# Altium schematic sheet IOpins.SchDoc
size A
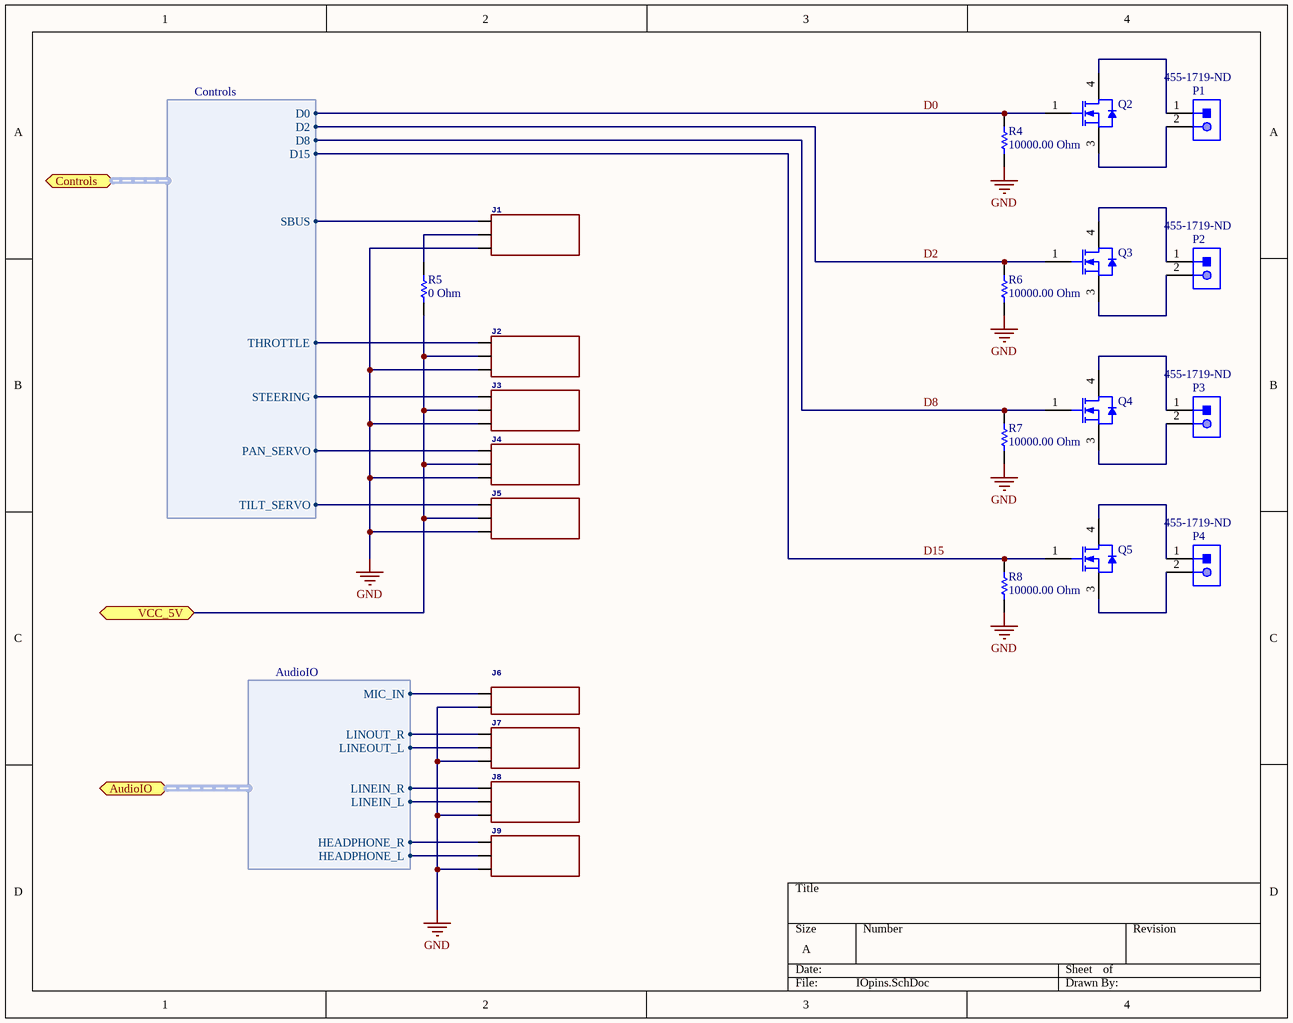
[diagram p0: IOpins.SchDoc]

## Parts
J1  Library:  MF_Connectors Description: Header Connector with 03 Positions and 01 Rows. Use the LABEL Attribute to label the pin on the schematic and PCB. You can remove the attributes on the PCB by using the SMASH function on the part and then deleting the text.  [PTH_2.54MM_01X03]  (value not drawn)
J2  Library:  MF_Connectors Description: Header Connector with 03 Positions and 01 Rows. Use the LABEL Attribute to label the pin on the schematic and PCB. You can remove the attributes on the PCB by using the SMASH function on the part and then deleting the text.  [PTH_2.54MM_01X03]  (value not drawn)
J3  Library:  MF_Connectors Description: Header Connector with 03 Positions and 01 Rows. Use the LABEL Attribute to label the pin on the schematic and PCB. You can remove the attributes on the PCB by using the SMASH function on the part and then deleting the text.  [PTH_2.54MM_01X03]  (value not drawn)
J4  Library:  MF_Connectors Description: Header Connector with 03 Positions and 01 Rows. Use the LABEL Attribute to label the pin on the schematic and PCB. You can remove the attributes on the PCB by using the SMASH function on the part and then deleting the text.  [PTH_2.54MM_01X03]  (value not drawn)
J5  Library:  MF_Connectors Description: Header Connector with 03 Positions and 01 Rows. Use the LABEL Attribute to label the pin on the schematic and PCB. You can remove the attributes on the PCB by using the SMASH function on the part and then deleting the text.  [PTH_2.54MM_01X03]  (value not drawn)
J6  Library:  MF_Connectors Description: Header Connector with 02 Positions and 01 Rows. Use the LABEL Attribute to label the pin on the schematic and PCB. You can remove the attributes on the PCB by using the SMASH function on the part and then deleting the text.  [PTH_2.54MM_01X02]  (value not drawn)
J7  Library:  MF_Connectors Description: Header Connector with 03 Positions and 01 Rows. Use the LABEL Attribute to label the pin on the schematic and PCB. You can remove the attributes on the PCB by using the SMASH function on the part and then deleting the text.  [PTH_2.54MM_01X03]  (value not drawn)
J8  Library:  MF_Connectors Description: Header Connector with 03 Positions and 01 Rows. Use the LABEL Attribute to label the pin on the schematic and PCB. You can remove the attributes on the PCB by using the SMASH function on the part and then deleting the text.  [PTH_2.54MM_01X03]  (value not drawn)
J9  Library:  MF_Connectors Description: Header Connector with 03 Positions and 01 Rows. Use the LABEL Attribute to label the pin on the schematic and PCB. You can remove the attributes on the PCB by using the SMASH function on the part and then deleting the text.  [PTH_2.54MM_01X03]  (value not drawn)
P1  Supplier Part Number 1: 455-1719-ND  [JST-S2B-PH-K-S_V]  (hidden comment: S2B-PH-K-S(LF)(SN))
P2  Supplier Part Number 1: 455-1719-ND  [JST-S2B-PH-K-S_V]  (hidden comment: S2B-PH-K-S(LF)(SN))
P3  Supplier Part Number 1: 455-1719-ND  [JST-S2B-PH-K-S_V]  (hidden comment: S2B-PH-K-S(LF)(SN))
P4  Supplier Part Number 1: 455-1719-ND  [JST-S2B-PH-K-S_V]  (hidden comment: S2B-PH-K-S(LF)(SN))
Q2  NTD5867NLT4G  [ONSC-DPAK-3-369AA-01_V]  (value not drawn)
Q3  NTD5867NLT4G  [ONSC-DPAK-3-369AA-01_V]  (value not drawn)
Q4  NTD5867NLT4G  [ONSC-DPAK-3-369AA-01_V]  (value not drawn)
Q5  NTD5867NLT4G  [ONSC-DPAK-3-369AA-01_V]  (value not drawn)
R4  value 10000.00 Ohm  [RESC0402(1005)_N]  (hidden comment: 2K 5% 0402(1005))
R5  value 0 Ohm  [RESC0402(1005)_N]  (hidden comment: 2K 5% 0402(1005))
R6  value 10000.00 Ohm  [RESC0402(1005)_N]  (hidden comment: 2K 5% 0402(1005))
R7  value 10000.00 Ohm  [RESC0402(1005)_N]  (hidden comment: 2K 5% 0402(1005))
R8  value 10000.00 Ohm  [RESC0402(1005)_N]  (hidden comment: 2K 5% 0402(1005))

## Ports
AudioIO (harness AudioIO), Controls (harness Controls), VCC_5V

## Harnesses
AudioIO: HEADPHONE_L, HEADPHONE_R, LINEIN_L, LINEIN_R, LINEOUT_L, LINOUT_R, MIC_IN
Controls: D0, D15, D2, D8, PAN_SERVO, SBUS, STEERING, THROTTLE, TILT_SERVO

## Nets
GND: J1.P$3(PIN3) J2.P$3(PIN3) J3.P$3(PIN3) J4.P$3(PIN3) J5.P$3(PIN3) J6.P$2(PIN2) J7.P$3(PIN3) J8.P$3(PIN3) J9.P$3(PIN3) R4.1 R6.1 R7.1 R8.1
D0: Q2.1(G) R4.2 ; port Controls.D0
D2: Q3.1(G) R6.2 ; port Controls.D2
D8: Q4.1(G) R7.2 ; port Controls.D8
D15: Q5.1(G) R8.2 ; port Controls.D15
VCC_5V: J2.P$2(PIN2) J3.P$2(PIN2) J4.P$2(PIN2) J5.P$2(PIN2) R5.1 ; port VCC_5V
NetJ1_P$1: J1.P$1(PIN1) ; port Controls.SBUS
NetJ1_P$2: J1.P$2(PIN2) R5.2
NetJ2_P$1: J2.P$1(PIN1) ; port Controls.THROTTLE
NetJ3_P$1: J3.P$1(PIN1) ; port Controls.STEERING
NetJ4_P$1: J4.P$1(PIN1) ; port Controls.PAN_SERVO
NetJ5_P$1: J5.P$1(PIN1) ; port Controls.TILT_SERVO
NetJ6_P$1: J6.P$1(PIN1) ; port AudioIO.MIC_IN
NetJ7_P$1: J7.P$1(PIN1) ; port AudioIO.LINOUT_R
NetJ7_P$2: J7.P$2(PIN2) ; port AudioIO.LINEOUT_L
NetJ8_P$1: J8.P$1(PIN1) ; port AudioIO.LINEIN_R
NetJ8_P$2: J8.P$2(PIN2) ; port AudioIO.LINEIN_L
NetJ9_P$1: J9.P$1(PIN1) ; port AudioIO.HEADPHONE_R
NetJ9_P$2: J9.P$2(PIN2) ; port AudioIO.HEADPHONE_L
NetP1_1: P1.1 Q2.4(D)
NetP1_2: P1.2 Q2.3(S)
NetP2_1: P2.1 Q3.4(D)
NetP2_2: P2.2 Q3.3(S)
NetP3_1: P3.1 Q4.4(D)
NetP3_2: P3.2 Q4.3(S)
NetP4_1: P4.1 Q5.4(D)
NetP4_2: P4.2 Q5.3(S)

## Library data of the parts
J1-J5 J7-J9 = CON_01X03_PTH_2.54MM: HOUSEPART: YES; MPN: MF-CON-2.54mm-01x03; GateName_1: G$1; POPULATE: 1; SymbolName_1: CON_01X03; DeviceName: _PTH_2.54MM; LibraryName: MF_Connectors; DeviceSetName: CON_01X03; URL: https://factory.macrofab.com/part/MF-CON-2.54mm-01x03
J6 = CON_01X02_PTH_2.54MM: HOUSEPART: YES; MPN: MF-CON-2.54mm-01x02; GateName_1: G$1; POPULATE: 1; SymbolName_1: CON_01X02; DeviceName: _PTH_2.54MM; LibraryName: MF_Connectors; DeviceSetName: CON_01X02; URL: https://factory.macrofab.com/part/MF-CON-2.54mm-01x02
P1-P4 = CMP-1755-00004-1: Male Header, Pitch 2 mm, 1 x 2 Position, Height 4.8 mm, Tail Length 3.4 mm, -25 to 85 degC, RoHS, Bulk; Case\Package: Radial; Tolerance: 20%; Capacitance: 10 uF; Voltage Rating (DC): 50 V; Packaging: Bulk; ComponentLink1URL: http://www.jst-mfg.com/product/pdf/eng/ePH.pdf; Radiation Hardening: No; Height: 11 mm; Package Quantity: 200; PackageDescription: Male Header, Pitch 2 mm, 1 x 2 Position, Height 4.8 mm, Tail Length 3.4 mm; PackageReference: S2B-PH-K-S; Diameter: 5 mm; Pins: 2; Mount: Through Hole; Max Operating Temperature: 85 degC; Min Operating Temperature: -40 degC; ComponentLink1Description: Datasheet; DatasheetVersion: Dec-12; Length: 11 mm; Lead Pitch: 2 mm; REACH SVHC: No SVHC; Voltage Rating: 50 V; RoHSCompliant: true; Supplier 1: Digi-Key
Q2-Q5 = CMP-1058-00318-1: N-Channel Power MOSFET, 60 V, 20 A, 39 mOhm, 3-Pin DPAK, Pb-Free, Tape and Reel; Manufacturer: On Semiconductor; V(BR)DSS Min (V): 60; Channel Polarity: N Channel; VGS(th) Max (V): 2.5; Coss Typ (pF): 68; Ciss Typ (pF): 675; Configuration: Single; Qrr Typ (nC): 12; PD Max (W): 36; Crss Typ (pF): 47; ComponentLink3URL: http://www.onsemi.cn/pub_link/Collateral/369AA.PDF; Packing: Tape and Reel; ComponentLink1URL: http://www.onsemi.com/; RoHS: Pb-Free; PartNumber: NTD5867NLT4G; DatasheetVersion: Rev. 2; PackageReference: DPAK-3-369AA-01; Package Type: DPAK-3, IPAK-4; PackageVersion: Rev. B, 06/2010; Mounting Technology: Surface Mount; ComponentLink2URL: http://www.onsemi.com/pub/Collateral/NTD5867NL-D.PDF; ComponentLink1Description: Manufacturer URL; ComponentLink2Description: Datasheet; ComponentLink3Description: Package Specification; PackageDescription: 3-Pin Flange Mount, Body 6.54 x 6.095 mm, Pitch 2.29 mm; Supplier 1: Digi-Key; Supplier Part Number 1: NTD5867NLT4GOSCT-ND
R4-R8 = CMP-1011-00081-1: 10K 0.063W 5% 0402 (1005 Metric)  SMD; HOUSEPART: MF-RES-0402-10K; Case-EIA: 0402; Case-Metric: 1005; Power: 0.063 W; Technology: SMT; Tolerance: 5 %; Supplier 1: Digi-Key
  R4 R6-R8: Supplier Part Number 1: P10KJCT-ND
  R5: Supplier Part Number 1: 1276-3480-1-ND